# EAGLE design mbed (EAGLE 9.6.2)
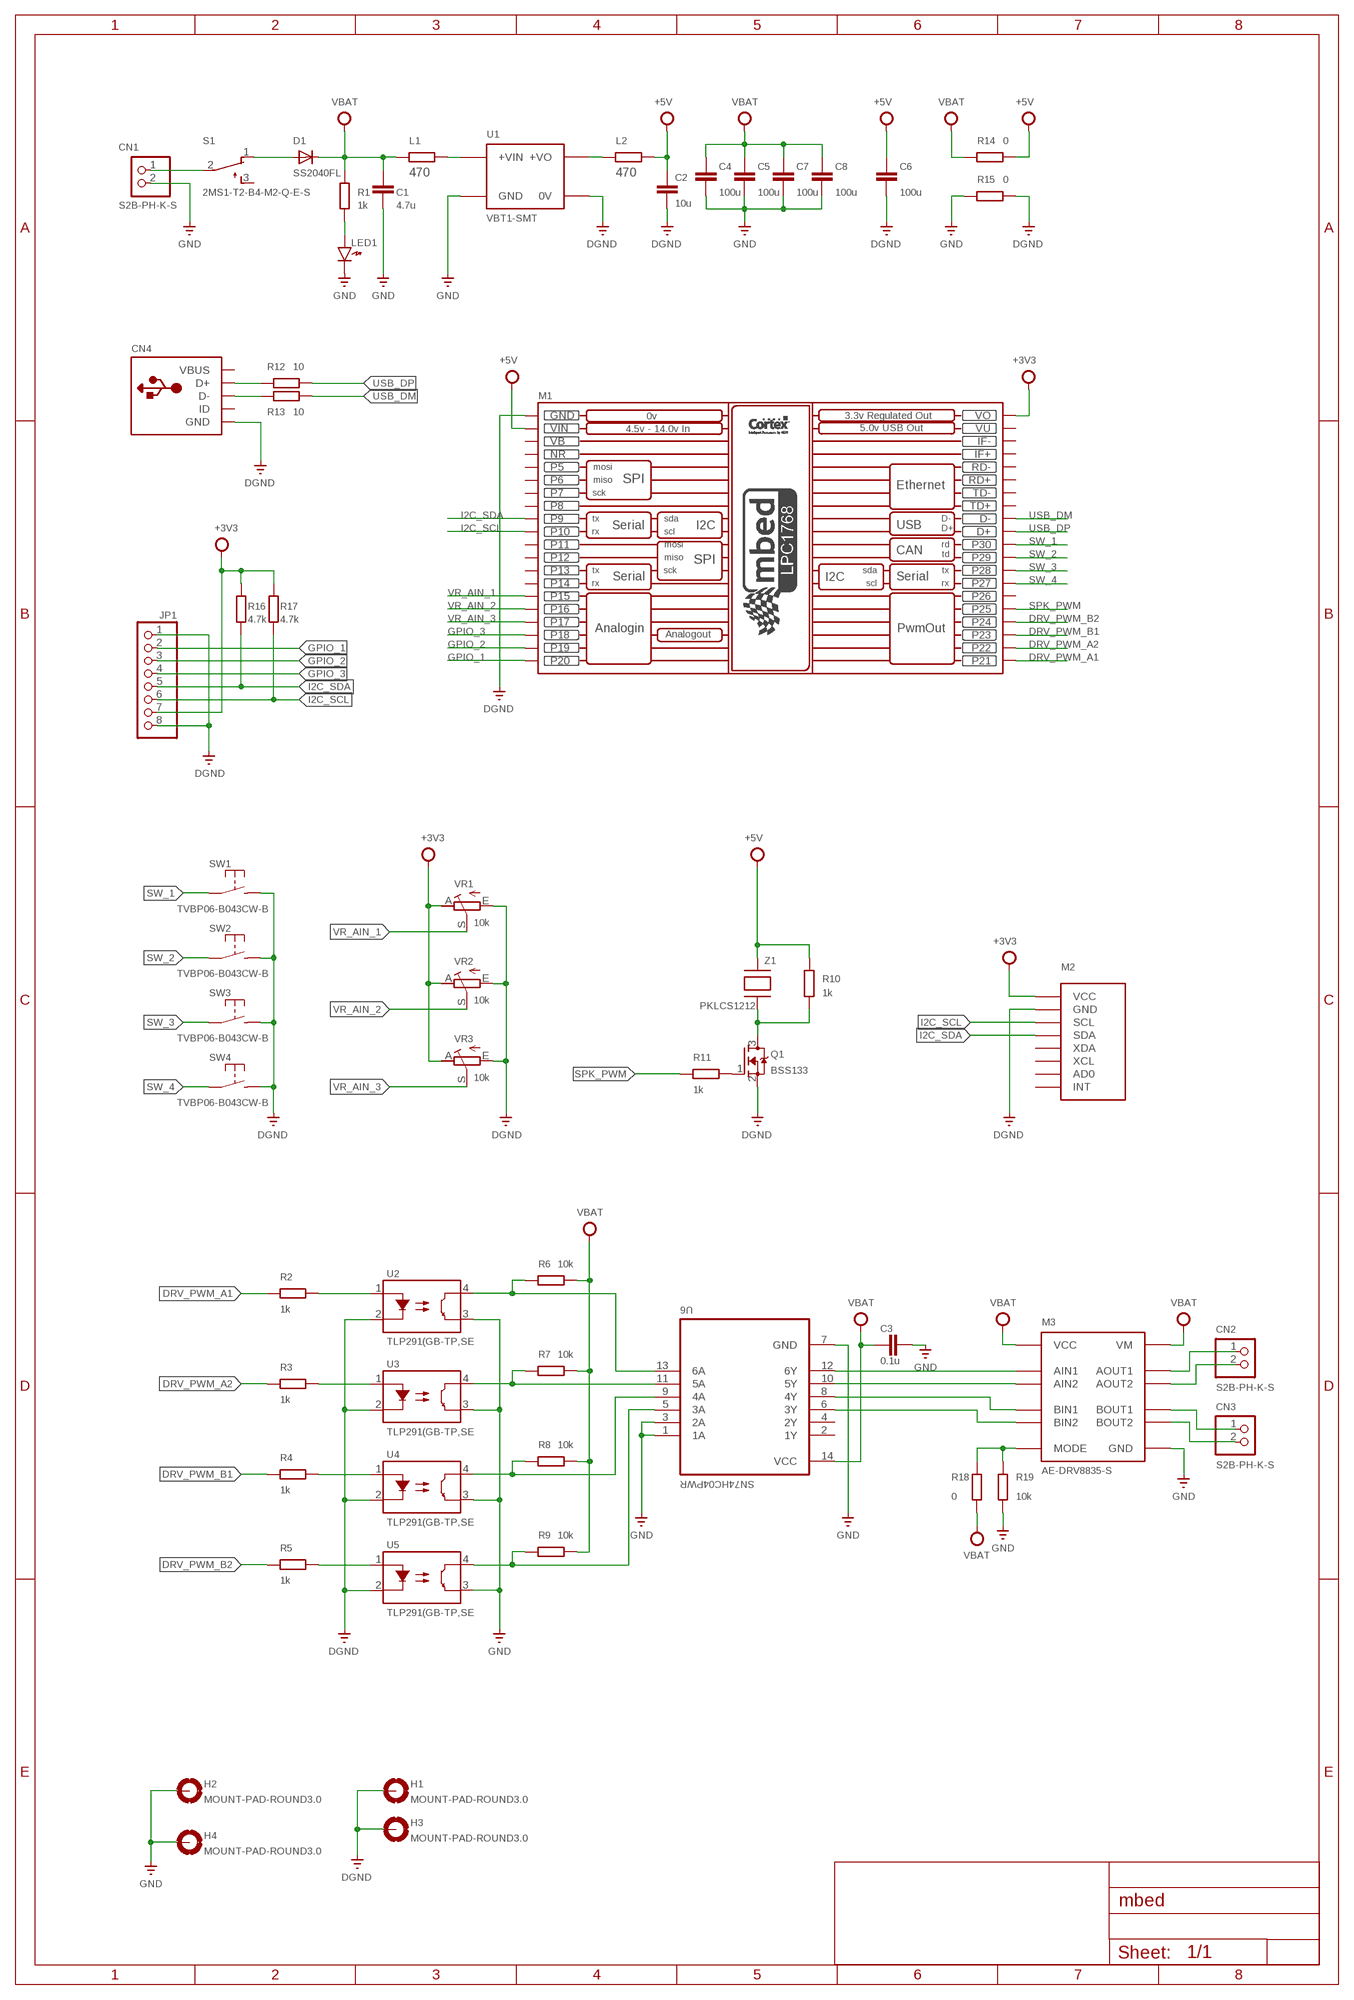
[diagram p0: schematic, sheet 1]

## Parts
C1  4.7u  C-EUC0603K  [C0603K]
C2  10u  C-EUC0603K  [C0603K]
C3  0.1u  C-EUC0603K  [C0603K]
C4  100u  C-EUC1206K  [C1206K]
C5  100u  C-EUC1206K  [C1206K]
C6  100u  C-EUC1206K  [C1206K]
C7  100u  C-EUC1206K  [C1206K]
C8  100u  C-EUC1206K  [C1206K]
CN1  S2B-PH-K-S  JST_2PIN-THM-RA  [JST-PH-2-THM-RA]
CN2  S2B-PH-K-S  JST_2PIN-THM-RA  [JST-PH-2-THM-RA]
CN3  S2B-PH-K-S  JST_2PIN-THM-RA  [JST-PH-2-THM-RA]
CN4  USBMINIB  [USB-MINIB]
D1  SS2040FL  DIODESOD-123  [SOD-123]
H1  MOUNT-PAD-ROUND3.0  [3,0-PAD]
H2  MOUNT-PAD-ROUND3.0  [3,0-PAD]
H3  MOUNT-PAD-ROUND3.0  [3,0-PAD]
H4  MOUNT-PAD-ROUND3.0  [3,0-PAD]
JP1  PINHD-1X8BIG  [1X08-BIG]
L1  470  R-EU_R0603  [R0603]
L2  470  R-EU_R0603  [R0603]
LED1  LED_1608  [LED_1608]
M1  MBED_NXP_LPC1768  [MBED-KIT]
M2  MPU6050(GY-521)  [MPU6050]
M3  AE-DRV8835-S  [DIL12]
Q1  BSS133  MOSFET-NREFLOW  [SOT23]
R1  1k  R-EU_R0603  [R0603]
R2  1k  R-EU_R0603  [R0603]
R3  1k  R-EU_R0603  [R0603]
R4  1k  R-EU_R0603  [R0603]
R5  1k  R-EU_R0603  [R0603]
R6  10k  R-EU_R0603  [R0603]
R7  10k  R-EU_R0603  [R0603]
R8  10k  R-EU_R0603  [R0603]
R9  10k  R-EU_R0603  [R0603]
R10  1k  R-EU_R0603  [R0603]
R11  1k  R-EU_R0603  [R0603]
R12  10  R-EU_R0603  [R0603]
R13  10  R-EU_R0603  [R0603]
R14  0  R-EU_R0603  [R0603]
R15  0  R-EU_R0603  [R0603]
R16  4.7k  R-EU_R0603  [R0603]
R17  4.7k  R-EU_R0603  [R0603]
R18  0  R-EU_R0603  [R0603]
R19  10k  R-EU_R0603  [R0603]
S1  2MS1-T2-B4-M2-Q-E-S  TL32PO  [TL3XPO]
SW1  TVBP06-B043CW-B  TUCT_SW_MINI  [SW1]
SW2  TVBP06-B043CW-B  TUCT_SW_MINI  [SW1]
SW3  TVBP06-B043CW-B  TUCT_SW_MINI  [SW1]
SW4  TVBP06-B043CW-B  TUCT_SW_MINI  [SW1]
U1  VBT1-SMT  [VBT1-SMT]
U2  TLP291(GB-TP,SE  [SOIC127P700X220-4N]
U3  TLP291(GB-TP,SE  [SOIC127P700X220-4N]
U4  TLP291(GB-TP,SE  [SOIC127P700X220-4N]
U5  TLP291(GB-TP,SE  [SOIC127P700X220-4N]
U6  SN74HC04PWR  SN74HC04PW  [SOP65P640X120-14N]
VR1  10k  VR-BOURNS  [VR-BOURNS]
VR2  10k  VR-BOURNS  [VR-BOURNS]
VR3  10k  VR-BOURNS  [VR-BOURNS]
Z1  PKLCS1212  [PKLCS1212]

## Nets
+3V3: JP1.7 M1.VOUT(VO) M2.P$1(VCC) R16.2 R17.2 VR1.A VR2.A VR3.A
+5V: C2.1 C6.1 L2.2 M1.VIN R10.2 R14.1 Z1.P$2
DGND: C2.2 C6.2 CN4.GND H1.B3,0(MOUNT) H3.B3,0(MOUNT) JP1.1 JP1.8 M1.GND M2.P$2(GND) Q1.2(S) R15.1 SW1.P$2(S) SW2.P$2(S) SW3.P$2(S) SW4.P$2(S) U1.P$4(0V) U2.2(C) U3.2(C) U4.2(C) U5.2(C) VR1.E VR2.E VR3.E
DRV_PWM_A1: M1.P$21(P21) R2.2
DRV_PWM_A2: M1.P$22(P22) R3.2
DRV_PWM_B1: M1.P$23(P23) R4.2
DRV_PWM_B2: M1.P$24(P24) R5.2
GND: C1.2 C3.2 C4.2 C5.2 C7.2 C8.2 CN1.2 H2.B3,0(MOUNT) H4.B3,0(MOUNT) LED1.K M3.P$6(GND) R15.2 R19.2 U1.P$1(GND) U2.3(EMIT) U3.3(EMIT) U4.3(EMIT) U5.3(EMIT) U6.1(1A) U6.3(2A) U6.7(GND)
GPIO_1: JP1.2 M1.P$20(P20)
GPIO_2: JP1.3 M1.P$19(P19)
GPIO_3: JP1.4 M1.P$18(P18)
I2C_SCL: JP1.6 M1.P$10(P10) M2.P$3(SCL) R17.1
I2C_SDA: JP1.5 M1.P$9(P9) M2.P$4(SDA) R16.1
N$1: L2.1 U1.P$5(+VO)
N$2: CN1.1 S1.2(P)
N$3: LED1.A R1.1
N$4: Q1.3(D) R10.1 Z1.P$1
N$5: Q1.1(G) R11.1
N$6: M3.P$8(BIN1) U6.8(4Y)
N$7: M3.P$7(BIN2) U6.6(3Y)
N$8: M3.P$10(AIN1) U6.12(6Y)
N$9: CN2.1 M3.P$2(AOUT1)
N$10: CN2.2 M3.P$3(AOUT2)
N$11: CN3.1 M3.P$4(BOUT1)
N$12: CN3.2 M3.P$5(BOUT2)
N$13: R5.1 U5.1(A)
N$14: R4.1 U4.1(A)
N$15: R3.1 U3.1(A)
N$16: R2.1 U2.1(A)
N$17: R9.2 U5.4(COL) U6.5(3A)
N$18: R8.1 U4.4(COL) U6.9(4A)
N$19: R7.1 U3.4(COL) U6.11(5A)
N$20: R6.1 U2.4(COL) U6.13(6A)
N$21: D1.A S1.1(O)
N$22: M3.P$11(MODE) R18.1 R19.1
N$23: CN4.D- R13.1
N$24: CN4.D+ R12.1
N$25: L1.2 U1.P$2(+VIN)
N$31: M3.P$9(AIN2) U6.10(5Y)
SPK_PWM: M1.P$25(P25) R11.2
SW_1: M1.P$30(P30) SW1.P$1(P)
SW_2: M1.P$29(P29) SW2.P$1(P)
SW_3: M1.P$28(P28) SW3.P$1(P)
SW_4: M1.P$27(P27) SW4.P$1(P)
USB_DM: M1.D- R13.2
USB_DP: M1.D+ R12.2
VBAT: C1.1 C3.1 C4.1 C5.1 C7.1 C8.1 D1.C L1.1 M3.P$1(VM) M3.P$12(VCC) R1.2 R6.2 R7.2 R8.2 R9.1 R14.2 R18.2 U6.14(VCC)
VR_AIN_1: M1.P$15(P15) VR1.S
VR_AIN_2: M1.P$16(P16) VR2.S
VR_AIN_3: M1.P$17(P17) VR3.S
Unconnected: CN4.ID M1.IF+ M1.IF- M1.P$5(P5) M1.P$6(P6) M1.P$7(P7) M1.P$8(P8) M1.P$11(P11) M1.P$12(P12) M1.P$13(P13) M1.P$14(P14) M1.P$26(P26) M1.RD+ M1.RD- M1.TD+ M1.TD- M2.P$5(XDA) M2.P$6(XCL) M2.P$7(AD0) M2.P$8(INT) S1.3(S) U6.2(1Y) U6.4(2Y)

## Notes on the sheet
- U1
- SW1
- TVBP06-B043CW-B
- SW2
- TVBP06-B043CW-B
- SW3
- TVBP06-B043CW-B
- SW4
- TVBP06-B043CW-B

## Power pins joined to a net without a drawn wire
NR: M1.NR
VB: M1.VB
VBUS: CN4.VBUS
VU: M1.VU

## Library data of the parts
C1-C8 = rcl:C-EU: CAPACITOR, European symbol; SPICEPREFIX: C
CN1-CN3 = adafruit:JST_2PIN: JST 2-Pin Connectors of various flavors SMT-RA (S2B-PH-SM4) 4UConnector #17311 SMT (B2B-PH-SM4) THM-RA (S2B-PH) THM (B2B-PH)
CN4 = adafruit:USB: USB Connectors USBMINIB - Surface Mount Female Mini-B USB Connector 4UConnector: 06564 By microbuilder.eu Thru-hole RA Female Mini-B USB Connector 4UConnector: 18732 By ladyada.net
D1 = adafruit:DIODE: Diode SMADIODE - SMA Surface Mount Package 20V 1A Schottky Diode Digikey: 641-1014-6-ND DO-1N4148 - Through Hole Small Current Diode SOD-123 20V 1 A (.5mV Vf) Schottky Diode - Digikey: MBRX120TPMSCT-ND SOD-323 10V 570mA (.38mV Vf, 3ns) Schottky Diode - Digikey: ZLLS410CT-ND SOD-523 30V 30mA Schottky Diode (RB751S-40TE61) - Digikey: RB751S-40TE61CT-ND SOT23-R/W - SOT23 Package (R = Solder Paste/Reflow Ovens, W = Hand-Soldering) BAT54Film 40V 300mA - Digikey: 497-7162-1-ND
H1-H4 = holes:MOUNT-PAD-ROUND: MOUNTING PAD, round
JP1 = adafruit:PINHD-1X8: PIN HEADER
L1 L2 R1-R19 = rcl:R-EU_: RESISTOR, European symbol; SPICEPREFIX: R
LED1 = Fugu_Generic:LED_1608
M1 = MBED_v2.1:MBED_NXP_LPC1768: Mbed LPC1768 - ARM CORTEX v2.1 * Schematic symbol is now placed in eagles's default raster. *The pads diameter are suitable for routing between mbed pins * mbed pads are 0.8 mm drill diameter. --------------------------------------------- Created by: Mohamed Yousry *Alexandria, Egypt *Email: mohamed.yousry@ieeegoldegypt.org
M2 = Fugu_LSI:MPU6050(GY-521)
M3 = Fugu_LSI:AE-DRV8835-S
Q1 = adafruit:MOSFET-N: N-Channel Mosfet 2N7002E - 60V 260mA SOT23 [Digikey: 2N7002ET1GOSTR-ND] - REEL BSH103 - 30V 850mA SOT23 [Digikey: 568-5013-1-ND]
S1 = switch:TL32PO: TINY SWITCH ON - MOM Source: http://www2.produktinfo.conrad.com/datenblaetter/700000-724999/705152-da-01-de-Subminiaturschalter_TL_36YO.pdf
SW1-SW4 = Fugu_Generic:TUCT_SW_MINI: TVBP06
U1 = Fugu_LSI:VBT1-SMT
U2-U5 = TLP291_GB-TP_SE:TLP291(GB-TP,SE: Optoisolator Transistor Output 3750Vrms 1 Channel 4-SO Check prices <https://pricing.snapeda.com/parts/TLP291%28GB-TP%2CSE/Toshiba%20Semiconductor/view-part?ref=eda>; AVAILABILITY: In Stock; DESCRIPTION: Optoisolator Transistor Output 3750Vrms 1 Channel 4-SO; MF: Toshiba Semiconductor; MP: TLP291(GB-TP,SE; PACKAGE: SO-4 Toshiba Semiconductor; PRICE: None; PURCHASE-URL: https://pricing.snapeda.com/search/part/TLP291(GB-TP,SE/?ref=eda
U6 = SN74HC04PW:SN74HC04PW
VR1-VR3 = Fugu_Generic:VR-BOURNS
Z1 = Fugu_Generic:PKLCS1212: murata small piezoelectric buzzer

## Board
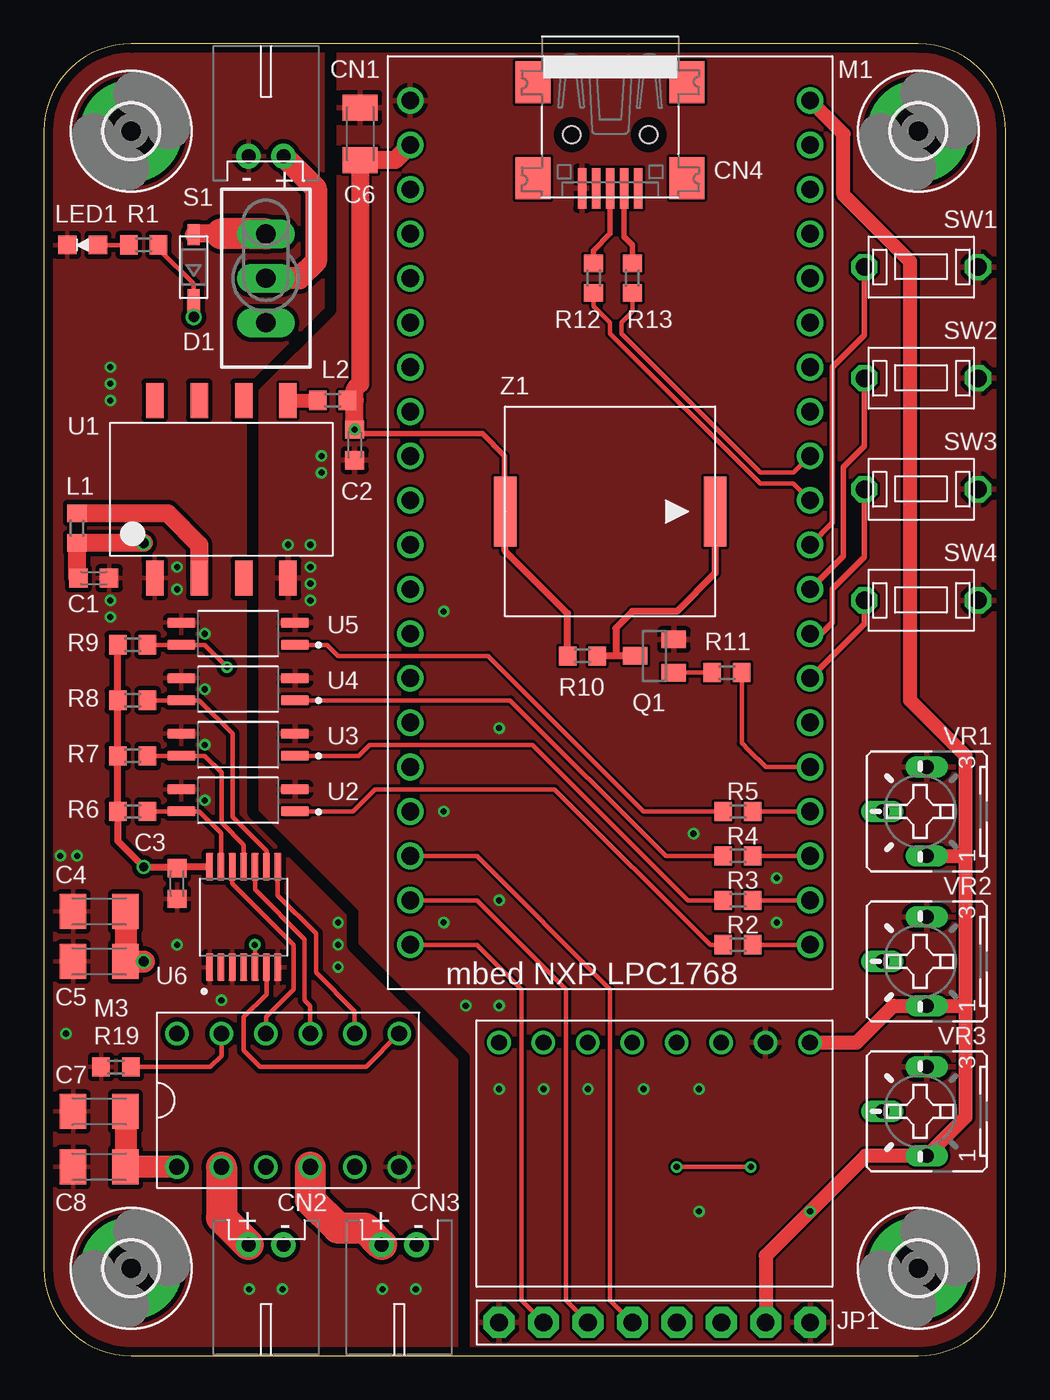
[diagram p1: board, top side]
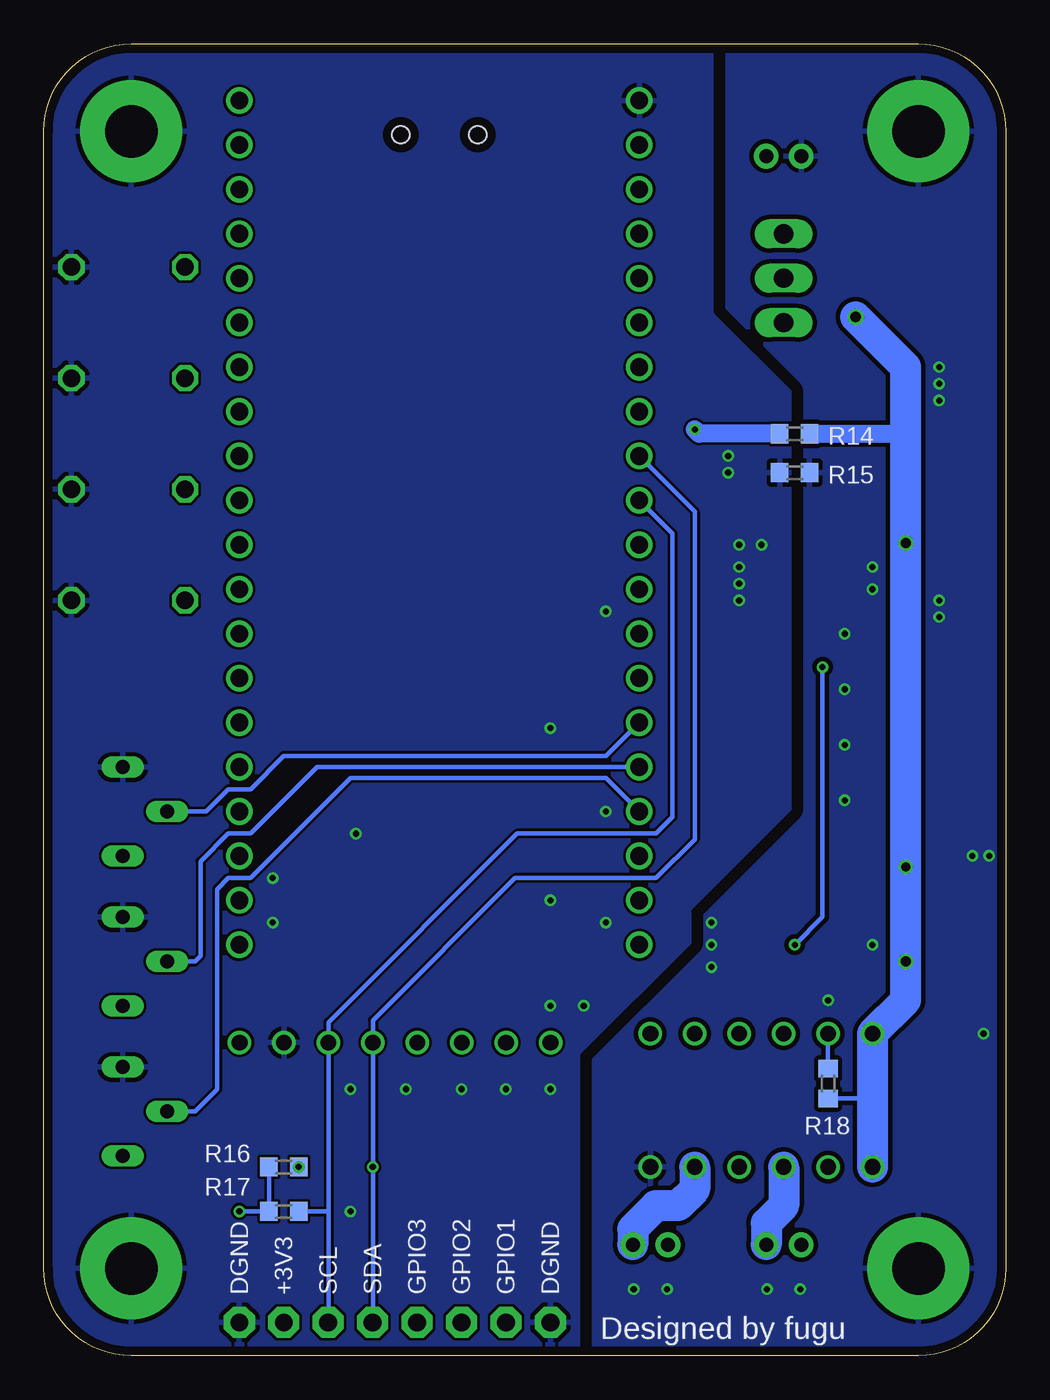
[diagram p2: board, bottom side, seen from below]

Size 55 x 75 mm. Coordinates in mm from the lower left corner, seen from the top.
Outline: 0,70 0,5 arc90 5,0 50,0 arc90 55,5 55,70 arc90 50,75 5,75 arc90 0,70
Copper layers (1*16): Top 0.035mm / dielectric 1.6mm / Bottom 0.035mm
Design rules "Elecrow_2-layer_PCB_eagle_rule": minimum track width 6mil, minimum drill 12mil, track to track 6mil, track to pad 6mil, pad to pad 6mil, via to via 8mil, smd to smd 0mil, copper to edge 20mil, drill to drill 10mil, minimum pad ring 6mil, minimum via ring 6mil, stop-mask expansion 0mil, vias tented up to drill 100mil, thermal gap 10mil
tRestrict: 7 lines
bRestrict: 7 lines

### Footprints (pad centres in the part's own frame; a part is rotated, then mirrored left to right if it is on the bottom)
C0603K = smd 1.05 x 1.08: 1 -0.875,0; 2 0.875,0
C1206K = smd 1.5 x 2: 1 -1.5,0; 2 1.5,0
JST-PH-2-THM-RA = drill 0.8 pad 1.422: 1 1,0; 2 -1,0
USB-MINIB = smd 0.5 x 2.308: D+ 0,4.064; D- -0.8,4.064; GND 1.6,4.064; ID 0.8,4.064; VBUS -1.6,4.064 | smd 2 x 2.4: GND1 -4.4,-2; GND2 -4.4,3.5; GND3 4.4,3.5; GND4 4.4,-2 | hole 1: -2.2,1; 2.2,1
SOD-123 = smd 1.2 x 0.7: A 1.85,0; C -1.85,0
3,0-PAD = drill 3 pad 5.842: B3,0 0,0
1X08-BIG = drill 1.016 pad 1.778 octagon: 1 -8.89,0; 2 -6.35,0; 3 -3.81,0; 4 -1.27,0; 5 1.27,0; 6 3.81,0; 7 6.35,0; 8 8.89,0
R0603 = smd 1 x 1.1: 1 -0.85,0; 2 0.85,0
LED_1608 = smd 1.05 x 1.08: A -0.875,0; K 0.875,0
MBED-KIT = drill 1.016: D+ 11.43,1.27; D- 11.43,3.81; GND -11.43,24.13; IF+ 11.43,16.51; IF- 11.43,19.05; NR -11.43,16.51; P$5 -11.43,13.97; P$6 -11.43,11.43; P$7 -11.43,8.89; P$8 -11.43,6.35; P$9 -11.43,3.81; P$10 -11.43,1.27; P$11 -11.43,-1.27; P$12 -11.43,-3.81; P$13 -11.43,-6.35; P$14 -11.43,-8.89; P$15 -11.43,-11.43; P$16 -11.43,-13.97; P$17 -11.43,-16.51; P$18 -11.43,-19.05; P$19 -11.43,-21.59; P$20 -11.43,-24.13; P$21 11.43,-24.13; P$22 11.43,-21.59; P$23 11.43,-19.05; P$24 11.43,-16.51; P$25 11.43,-13.97; P$26 11.43,-11.43; P$27 11.43,-8.89; P$28 11.43,-6.35; P$29 11.43,-3.81; P$30 11.43,-1.27; RD+ 11.43,11.43; RD- 11.43,13.97; TD+ 11.43,6.35; TD- 11.43,8.89; VB -11.43,19.05; VIN -11.43,21.59; VOUT 11.43,24.13; VU 11.43,21.59
MPU6050 = drill 0.9: P$1 -6.985,8.89; P$2 -6.985,6.35; P$3 -6.985,3.81; P$4 -6.985,1.27; P$5 -6.985,-1.27; P$6 -6.985,-3.81; P$7 -6.985,-6.35; P$8 -6.985,-8.89
DIL12 = drill 0.9: P$1 -3.81,6.35; P$2 -3.81,3.81; P$3 -3.81,1.27; P$4 -3.81,-1.27; P$5 -3.81,-3.81; P$6 -3.81,-6.35; P$7 3.81,-6.35; P$8 3.81,-3.81; P$9 3.81,-1.27; P$10 3.81,1.27; P$11 3.81,3.81; P$12 3.81,6.35
SOT23 = smd 1 x 1.4: 1 -0.95,-1.1; 2 0.95,-1.1; 3 0,1.1
TL3XPO = drill 1.1 pad 1.422 long: 1 -2.54,0; 2 0,0; 3 2.54,0
SW1 = drill 1 octagon: P$1 0,-3.25; P$2 0,3.25
VBT1-SMT = smd 2 x 1: P$1 -5.08,3.81; P$2 -5.08,1.27; P$3 -5.08,-1.27; P$4 -5.08,-3.81; P$5 5.08,-3.81; P$6 5.08,-1.27; P$7 5.08,1.27; P$8 5.08,3.81
SOIC127P700X220-4N = smd 1.61 x 0.57: 1 -3.25,0.635; 2 -3.25,-0.635; 3 3.25,-0.635; 4 3.25,0.635
SOP65P640X120-14N = smd 1.57 x 0.41: 1 -2.87,1.95; 2 -2.87,1.3; 3 -2.87,0.65; 4 -2.87,0; 5 -2.87,-0.65; 6 -2.87,-1.3; 7 -2.87,-1.95; 8 2.87,-1.95; 9 2.87,-1.3; 10 2.87,-0.65; 11 2.87,0; 12 2.87,0.65; 13 2.87,1.3; 14 2.87,1.95
VR-BOURNS = drill 0.813 long: A -2.54,0; E 2.54,0; S 0,2.54
PKLCS1212 = smd 1.27 x 4: P$1 6,0; P$2 -6,0

### Placement (x,y rotation side)
C1  2.86,44.45 0 top
C2  17.78,52.07 270 top
C3  7.62,26.99 270 top
C4  3.17,25.4 180 top
C5  3.17,22.54 180 top
C6  18.1,69.85 90 top
C7  3.17,13.97 180 top
C8  3.17,10.79 180 top
CN1  12.7,68.58 0 top
CN2  12.7,6.35 180 top
CN3  20.32,6.35 180 top
CN4  32.38,70.8 180 top
D1  8.57,62.23 90 top
H1  50,5 0 top
H2  5,5 0 top
H3  50,70 0 top
H4  5,70 0 top
JP1  34.92,1.91 0 top
L1  1.91,47.31 90 top
L2  16.51,54.61 0 top
LED1  2.22,63.5 180 top
M1  32.38,47.62 0 top
M2  34.91,10.92 270 top
M3  13.97,14.61 90 top
Q1  34.92,40.01 90 top
R1  5.71,63.5 0 top
R2  39.69,23.5 0 top
R3  39.69,26.04 0 top
R4  39.69,28.57 0 top
R5  39.69,31.11 0 top
R6  5.08,31.11 180 top
R7  5.08,34.29 180 top
R8  5.08,37.47 180 top
R9  5.08,40.64 0 top
R10  30.8,40.01 180 top
R11  39.05,39.05 0 top
R12  31.43,61.59 270 top
R13  33.66,61.59 270 top
R14  12.06,52.7 0 bottom
R15  12.06,50.48 0 bottom
R16  41.27,10.79 180 bottom
R17  41.27,8.26 180 bottom
R18  10.16,15.56 270 bottom
R19  4.13,16.51 180 top
S1  12.7,61.59 270 top
SW1  50.16,62.23 270 top
SW2  50.16,55.88 270 top
SW3  50.16,49.53 270 top
SW4  50.16,43.18 270 top
U1  10.16,49.53 90 top
U2  11.11,31.75 180 top
U3  11.11,34.92 180 top
U4  11.11,38.1 180 top
U5  11.11,41.27 180 top
U6  11.43,25.08 90 top
VR1  50.48,31.11 90 top
VR2  50.48,22.54 90 top
VR3  50.48,13.97 90 top
Z1  32.38,48.26 0 top

### Tracks (layer width: path | path; a pad name or v marks a point on that pad's centre or on a via)
+3V3  (via drill 0.35)
  Top 0.813: M2.P$1 46.48,17.91 48.58,20 VR2.A 52.7,20 | 52.7,20 52.7,13.65 VR3.A 46.99,11.43 v43.81,8.26 41.27,5.71 JP1.7 | 52.7,20 52.7,28.57 | 52.7,28.57 52.7,34.29 49.53,37.47 49.53,62.55 45.72,66.36 45.72,69.85 M1.VOUT | VR1.A 52.7,28.57
  Bottom 0.254: R16.2 R17.2 v43.81,8.26
+5V  (via drill 0.35)
  Top 0.305: Z1.P$2 26.35,48.29 26.35,51.44 25.08,52.7 18.02,52.7 C2.1
  Top 0.406: R10.2 29.95,42.44 26.39,46.01 Z1.P$2
  Top 1.016: C2.1 17.78,54.61 | L2.2 17.78,54.61 | 17.78,54.61 17.78,55.24 18.1,55.56 C6.1 20.09,68.35 M1.VIN
  Bottom 1.016: C2.1 17.54,52.7 R14.1
  other vias: 17.78,52.95
DGND  (via drill 0.35)
  other vias: 15.24,45.09 15.24,44.13 15.24,43.18 26.04,20 24.13,20 22.86,31.11 26.04,26.04 22.86,24.77 37.15,29.84 41.91,24.77 41.91,27.3 26.04,35.88 22.86,42.55 31.11,15.24 28.57,15.24 26.04,15.24 37.47,15.24 34.29,15.24 37.47,8.26 13.97,46.35 15.24,46.35 15.88,51.44 15.88,50.48
  pour Top (rank 2): -3.81,78.74 57.78,78.74 57.78,-3.81 -3.81,-3.81
  pour Bottom (rank 2): -5.08,80 59.05,79.81 59.05,-5.08 -5.08,-5.08
DRV_PWM_A1
  Top 0.254: R2.2 M1.P$21
DRV_PWM_A2
  Top 0.254: R3.2 M1.P$22
DRV_PWM_B1
  Top 0.254: R4.2 M1.P$23
DRV_PWM_B2
  Top 0.254: R5.2 M1.P$24
GND  (via drill 0.35)
  other vias: 9.21,41.27 9.21,38.1 9.21,34.92 9.21,31.75 16.83,22.23 16.83,24.77 16.83,23.5 1.27,18.41 7.62,23.5 11.75,3.81 13.65,3.81 19.37,3.81 21.27,3.81 10.16,20.32 1.91,28.57 0.95,28.57 3.81,43.18 3.81,42.23 7.62,45.09 7.62,43.81 3.81,56.52 3.81,55.56 3.81,54.61
  pour Top (isolate 0.254): -1.27,76.2 16.51,76.2 16.51,59.69 12.06,55.24 12.06,31.11 17.78,25.4 17.78,23.5 24.13,17.14 24.13,-1.27 -1.27,-1.27
  pour Bottom (isolate 0.254): -2.54,77.47 16.51,77.47 16.51,59.69 12.06,55.24 12.06,31.11 17.78,25.4 17.78,23.5 24.13,17.14 24.13,-2.54 -2.54,-2.54
GPIO_1
  Top 0.254: M1.P$20 24.77,23.5 27.3,20.95 27.3,3.17 JP1.2
GPIO_2
  Top 0.254: M1.P$19 24.77,26.04 29.84,20.95 29.84,3.17 JP1.3
GPIO_3
  Top 0.254: M1.P$18 24.77,28.57 32.38,20.95 32.38,3.17 JP1.4
I2C_SCL
  Bottom 0.254: M1.P$10 19.05,46.99 19.05,30.8 20,29.84 27.94,29.84 38.73,19.06 M2.P$3 38.73,8.26 | R17.1 38.73,8.26 | JP1.6 38.73,8.26
I2C_SDA  (via drill 0.35)
  Top 0.254: R16.1 v36.19,10.79
  Bottom 0.254: M1.P$9 17.78,48.26 17.78,29.53 20,27.3 28.05,27.3 36.19,19.18 M2.P$4 v36.19,10.79 36.19,1.92 JP1.5
  other vias: 40.42,10.79
N$1
  Top 0.813: U1.P$5 L2.1
N$2
  Top 1.27: CN1.1 15.56,66.72 15.56,62.55 14.61,61.59 S1.2
N$3
  Top 0.254: R1.1 LED1.A
N$4
  Top 0.406: Q1.3 32.7,40.01 | 32.7,40.01 R10.1 | Z1.P$1 38.38,44.73 36.2,42.55 33.66,42.55 32.7,41.59 32.7,40.01
N$5
  Top 0.254: R11.1 Q1.1
N$6
  Top 0.254: U6.8 13.38,26.31 15.56,24.13 15.56,21.91 17.78,19.68 M3.P$8
N$7
  Top 0.254: U6.6 12.73,20.67 11.43,19.37 11.43,17.46 12.38,16.51 18.41,16.51 M3.P$7
N$8
  Top 0.254: U6.12 10.78,27 14.29,23.5 14.29,20.95 12.7,19.37 M3.P$10
N$9
  Top 1.778: CN2.1 10.16,7.89 M3.P$2
N$10
  Bottom 1.778: CN2.2 13.7,7.57 12.7,8.57 M3.P$3
N$11
  Top 1.778: M3.P$4 15.24,8.89 16.83,7.3 18.37,7.3 CN3.1
N$12
  Bottom 1.778: M3.P$5 17.78,9.53 18.73,8.57 20,8.57 21.32,7.25 CN3.2
N$13
  Top 0.254: R5.1 34.29,31.11 25.4,40.01 16.83,40.01 16.19,40.64 U5.1
N$14
  Top 0.254: R4.1 35.56,28.57 26.67,37.47 U4.1
N$15
  Top 0.254: R3.1 36.83,26.04 27.94,34.92 18.64,34.92 18,34.29 U3.1
N$16
  Top 0.254: R2.1 38.1,23.5 29.21,32.38 18.95,32.38 17.68,31.11 U2.1
N$17  (via drill 0.35)
  Top 0.254: v10.48,39.37 9.21,40.64 U5.4 R9.2 | v12.06,23.5 12.08,23.48 U6.5
  Bottom 0.254: v10.48,39.37 10.48,25.08 v12.06,23.5
N$18
  Top 0.254: U6.9 12.73,28.86 10.79,30.8 10.79,35.56 8.89,37.47 U4.4 R8.1
N$19
  Top 0.254: U6.11 11.43,29.21 10.16,30.48 10.16,33.34 9.21,34.29 U3.4 R7.1
N$20
  Top 0.254: U6.13 10.13,29.88 8.89,31.11 U2.4 R6.1
N$21
  Top 1.016: 10.16,64.14 8.63,64.14 D1.A
  Top 1.778: S1.1 10.16,64.14
N$22
  Top 0.254: R19.1 9.53,16.51 10.16,17.14 M3.P$11
  Bottom 0.254: M3.P$11 R18.1
N$23
  Top 0.305: CN4.D- 33.19,63.97 33.66,63.5 R13.1
N$24
  Top 0.305: CN4.D+ 32.38,64.14 31.43,63.18 R12.1
N$25
  Top 1.016: L1.2 7.09,48.16 8.89,46.35 U1.P$2
N$31
  Top 0.254: U6.10 12.08,26.66 14.92,23.81 14.92,20.32 15.24,20 M3.P$9
SPK_PWM
  Top 0.254: M1.P$25 41.27,33.66 40.32,34.61 39.9,35.03 R11.2
SW_1
  Top 0.305: SW1.P$1 46.91,58.34 45.09,56.52 45.09,47.62 M1.P$30
SW_2
  Top 0.305: SW2.P$1 46.91,51.99 45.72,50.8 45.72,45.72 M1.P$29
SW_3
  Top 0.305: SW3.P$1 46.91,45.65 45.09,43.81 45.09,41.91 44.45,41.27 M1.P$28
SW_4
  Top 0.305: SW4.P$1 46.91,41.84 M1.P$27
USB_DM
  Top 0.254: M1.D- 42.86,50.48 40.96,50.48 33.02,58.42 33.02,59.05 33.66,59.69 R13.2
USB_DP
  Top 0.254: M1.D+ 42.86,49.85 40.96,49.85 32.38,58.42 32.38,59.05 31.43,60.01 R12.2
VBAT  (via drill 0.5, 0.55, 0.6)
  Top 0.254: R1.2 6.67,63.4 6.67,63.18 8.57,61.28 D1.C
  Top 0.406: U6.14 7.71,27.95 7.7,27.94 | 7.7,27.94 C3.1 | 7.7,27.94 v5.71,27.94 4.23,29.43 R6.2 R7.2 R8.2 R9.1
  Top 0.762: D1.C v8.57,59.37
  Top 1.016: v5.71,46.46 L1.1 1.91,44.53 C1.1
  Top 1.27: C4.1 C5.1 v5.71,22.54 | C7.1 C8.1 M3.P$1
  Bottom 0.254: R18.2 7.62,14.71
  Bottom 1.016: R14.2 5.71,52.7
  Bottom 1.778: M3.P$1 7.62,14.71 M3.P$12 5.71,20.32 v5.71,22.54 v5.71,27.94 v5.71,46.46 5.71,52.7 5.71,56.52 v8.57,59.37
VR_AIN_1
  Bottom 0.254: M1.P$15 22.86,34.29 41.27,34.29 43.18,32.38 44.45,32.38 45.72,31.11 VR1.S
VR_AIN_2
  Bottom 0.254: M1.P$16 39.37,33.66 43.18,29.84 44.45,29.84 46.04,28.26 46.04,22.86 46.35,22.54 VR2.S
VR_AIN_3
  Bottom 0.254: M1.P$17 22.86,33.02 37.47,33.02 43.18,27.3 44.45,27.3 45.09,26.67 45.09,15.24 46.35,13.97 VR3.S

### Text on the board
bPlace: DGND | GPIO1 | GPIO2 | GPIO3 | SDA | SCL | +3V3 | DGND | Designed by fugu
tStop: PWR ON